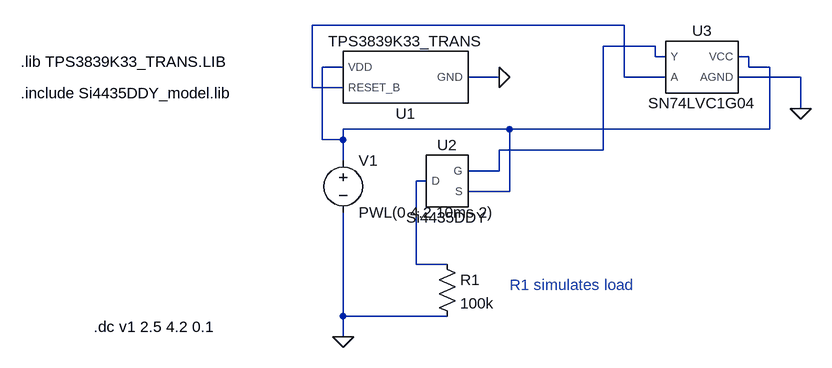
[diagram p0: schematic li-ion_lvc_sim.asc]
li-ion_lvc_sim.asc, the LTspice schematic file:
Version 4.1
SHEET 1 1192 724
WIRE 656 16 176 16
WIRE 704 48 624 48
WIRE 704 64 704 48
WIRE 720 64 704 64
WIRE 848 64 832 64
WIRE 224 80 192 80
WIRE 848 80 848 64
WIRE 880 80 848 80
WIRE 464 96 416 96
WIRE 656 96 656 16
WIRE 720 96 656 96
WIRE 928 96 832 96
WIRE 176 112 176 16
WIRE 224 112 176 112
WIRE 928 144 928 96
WIRE 480 176 224 176
WIRE 880 176 880 80
WIRE 880 176 480 176
WIRE 192 192 192 80
WIRE 224 192 224 176
WIRE 224 192 192 192
WIRE 624 208 624 48
WIRE 624 208 464 208
WIRE 224 224 224 192
WIRE 464 240 464 208
WIRE 464 240 416 240
WIRE 352 256 336 256
WIRE 480 272 480 176
WIRE 480 272 416 272
WIRE 336 384 336 256
WIRE 384 384 336 384
WIRE 224 464 224 304
WIRE 384 464 224 464
WIRE 224 496 224 464
FLAG 224 496 0
FLAG 464 96 0
FLAG 928 144 0
SYMBOL voltage 224 208 R0
WINDOW 123 0 0 Left 0
WINDOW 39 0 0 Left 0
SYMATTR InstName V1
SYMATTR Value PWL(0 4.2 10ms 2)
SYMBOL res 368 368 R0
SYMATTR InstName R1
SYMATTR Value 100k
SYMBOL TPS3839K33_TRANS 320 96 R180
SYMATTR InstName U1
SYMBOL Si4435DDY 384 256 R0
SYMATTR InstName U2
SYMBOL SN74LVC1G04 768 80 R0
SYMATTR InstName U3
TEXT -272 120 Left 2 !.include Si4435DDY_model.lib
TEXT -160 480 Left 2 !.dc v1 2.5 4.2 0.1
TEXT -272 72 Left 2 !.lib TPS3839K33_TRANS.LIB
TEXT 480 416 Left 2 ;R1 simulates load

The netlist it stands for:
* li-ion_lvc_sim.asc
V1 N003 0 PWL(0 4.2 10ms 2)
R1 N004 0 100k
X§U1 0 N001 N003 TPS3839K33_TRANS  ; pins GND RESET_B VDD
X§U2 N004 N002 N003 Si4435DDY  ; pins D G S
X§U3 N002 N001 N003 0 SN74LVC1G04  ; pins Y A VCC AGND
.include Si4435DDY_model.lib
.dc v1 2.5 4.2 0.1
.lib TPS3839K33_TRANS.LIB
* R1 simulates load
.lib C:\Users\adamk\Desktop\RSX\cansat_2026\RSX-Cansat-2026\electrical\spice_sims\TPS3839K33_TRANS.lib
.lib C:\Users\adamk\Desktop\RSX\cansat_2026\RSX-Cansat-2026\electrical\spice_sims\Si4435DDY_PS.lib
.lib C:\Users\adamk\Desktop\RSX\cansat_2026\RSX-Cansat-2026\electrical\spice_sims\SN74LVC1G04.cir
.backanno
.end